# Altium schematic sheet dsp.SchDoc
size A2
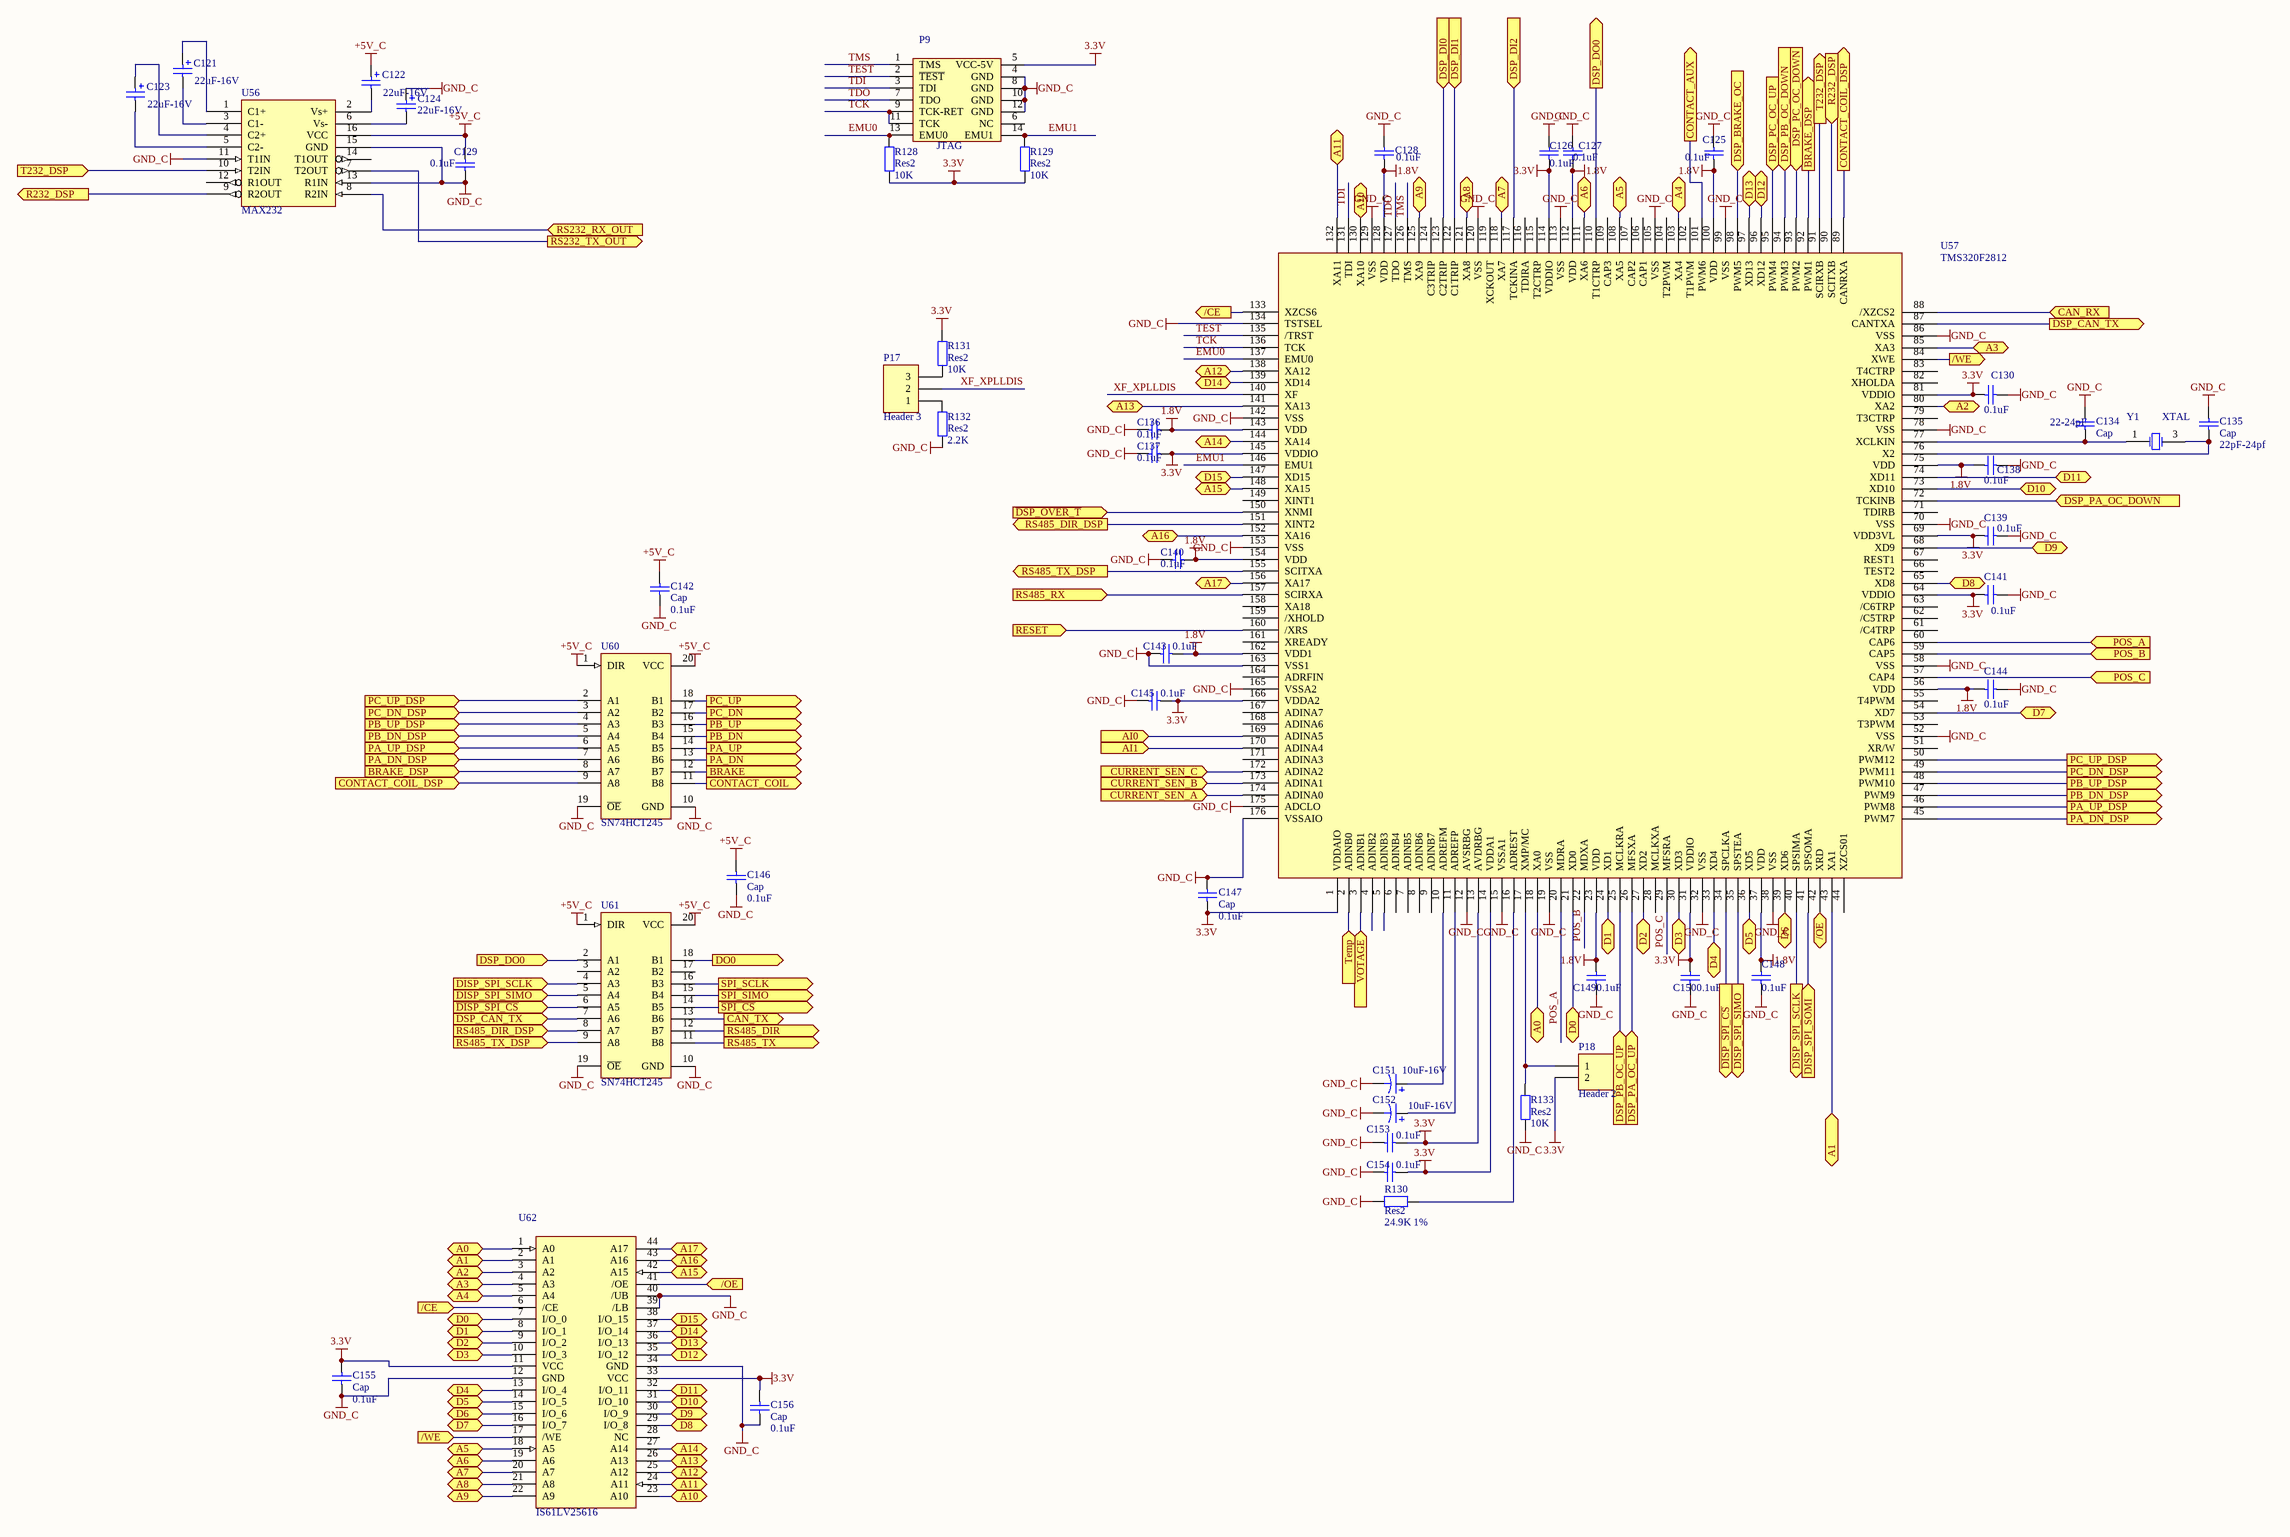
[diagram p0: dsp.SchDoc]

## Parts
C121  value 22uF-16V  [7343]  (hidden comment: 22uF)
C122  value 22uF-16V  [7343]  (hidden comment: 22uF)
C123  value 22uF-16V  [7343]  (hidden comment: 22uF)
C124  value 22uF-16V  [7343]  (hidden comment: 22uF)
C125  value 0.1uF  [1206]  (hidden comment: Cap)
C126  value 0.1uF  [1206]  (hidden comment: Cap)
C127  value 0.1uF  [1206]  (hidden comment: Cap)
C128  value 0.1uF  [1206]  (hidden comment: Cap)
C129  value 0.1uF  [1206]  (hidden comment: Cap)
C130  value 0.1uF  [1206]  (hidden comment: Cap)
C134  Cap  value 22-24pF  [1206]
C135  Cap  value 22pF-24pf  [1206]
C136  value 0.1uF  [1206]  (hidden comment: Cap)
C137  value 0.1uF  [1206]  (hidden comment: Cap)
C138  value 0.1uF  [1206]  (hidden comment: Cap)
C139  value 0.1uF  [1206]  (hidden comment: Cap)
C140  value 0.1uF  [1206]  (hidden comment: Cap)
C141  value 0.1uF  [1206]  (hidden comment: Cap)
C142  Cap  value 0.1uF  [1206]
C143  value 0.1uF  [1206]  (hidden comment: Cap)
C144  value 0.1uF  [1206]  (hidden comment: Cap)
C145  value 0.1uF  [1206]  (hidden comment: Cap)
C146  Cap  value 0.1uF  [1206]
C147  Cap  value 0.1uF  [1206]
C148  value 0.1uF  [1206]  (hidden comment: Cap)
C149  value 0.1uF  [1206]  (hidden comment: Cap)
C150  value 0.1uF  [1206]  (hidden comment: Cap)
C151  value 10uF-16V  [1206]  (hidden comment: Cap Pol1)
C152  value 10uF-16V  [1206]  (hidden comment: Cap Pol1)
C153  value 0.1uF  [1206]  (hidden comment: Cap)
C154  value 0.1uF  [1206]  (hidden comment: Cap)
C155  Cap  value 0.1uF  [1206]
C156  Cap  value 0.1uF  [1206]
P9  JTAG  [DIP14-2.54]
P17  Header 3  [HDR1X3]
P18  Header 2  [HDR1X2]
R128  Res2  value 10K  [1206]
R129  Res2  value 10K  [1206]
R130  Res2  value 24.9K 1%  [1206]
R131  Res2  value 10K  [1206]
R132  Res2  value 2.2K  [1206]
R133  Res2  value 10K  [1206]
U56  MAX232  [SO16_M]
U57  TMS320F2812  [LQFP176_N]
U60  SN74HCT245  [SO20_M]
U61  SN74HCT245  [SO20_M]
U62  IS61LV25616  [TSOP44 - duplicate]
Y1  XTAL  [SMD5032]

## Ports
/CE (in), /CE (out), /OE (in), /OE (out), /WE (in), /WE (out), A0, A1, A2, A3, A4, A5, A6, A7, A8, A9, A10, A11, A12, A13, A14, A15, A16, A17, AI0 (in), AI1 (in), BRAKE (out), BRAKE_DSP (in), BRAKE_DSP (out), CAN_RX (in), CAN_TX (out), CONTACT_AUX (out), CONTACT_COIL (out), CONTACT_COIL_DSP (in), CONTACT_COIL_DSP (out), CURRENT_SEN_A (in), CURRENT_SEN_B (in), CURRENT_SEN_C (in), D0, D1, D2, D3, D4, D5, D6, D7, D8, D9, D10, D11, D12, D13, D14, D15, DISP_SPI_SCLK (in), DISP_SPI_SCLK (out), DISP_SPI_SIMO (in), DISP_SPI_SIMO (out), DISP_SPI_SOMI (in), DO0 (out), DSP_BRAKE_OC (in), DSP_CAN_TX (in), DSP_CAN_TX (out), DSP_DI0 (in), DSP_DI1 (in), DSP_DI2 (in), DSP_DO0 (in), DSP_DO0 (out), DSP_PA_OC_DOWN (in), DSP_PA_OC_UP (in), DSP_PB_OC_DOWN (in), DSP_PB_OC_UP (in), DSP_PC_OC_DOWN (in), DSP_PC_OC_UP (in), PA_DN (out), PA_DN_DSP (in), PA_DN_DSP (out), PA_UP (out), PA_UP_DSP (in), PA_UP_DSP (out), PB_DN (out), PB_DN_DSP (in), PB_DN_DSP (out), PB_UP (out), PB_UP_DSP (in), PB_UP_DSP (out), PC_DN (out), PC_DN_DSP (in), PC_DN_DSP (out), PC_UP (out), PC_UP_DSP (in), PC_UP_DSP (out), POS_A (in), POS_B (in), POS_C (in), R232_DSP (in), R232_DSP (out), RESET (in), RS232_RX_OUT (in), RS232_TX_OUT (out), RS485_DIR (out), RS485_DIR_DSP (in), RS485_DIR_DSP (out), RS485_RX (in), RS485_TX (out), RS485_TX_DSP (in), RS485_TX_DSP (out), SPI_SCLK (out), SPI_SIMO (out), T232_DSP (in), T232_DSP (out), Temp (in), VOTAGE (in), ~{DISP_SPI_CS} (in), ~{DISP_SPI_CS} (out), ~{DSP_OVER_T} (in), ~{SPI_CS} (out)

## Nets
1.8V: C125.1 C127.1 C128.1 C136.1 C138.1 C140.1 C143.2 C144.1 C148.1 C149.1 U57.23(VDD) U57.37(VDD) U57.56(VDD) U57.75(VDD) U57.100(VDD) U57.112(VDD) U57.128(VDD) U57.143(VDD) U57.154(VDD) U57.162(VDD1)
3.3V: C126.1 C130.1 C137.1 C139.1 C141.1 C145.2 C147.2 C150.1 C153.2 C154.2 C155.2 C156.2 P9.5(VCC-5V) P18.2 R128.1 R129.1 R131.2 U57.1(VDDAIO) U57.13(AVDRBG) U57.14(VDDA1) U57.31(VDDIO) U57.64(VDDIO) U57.69(VDD3VL) U57.81(VDDIO) U57.114(VDDIO) U57.145(VDDIO) U57.166(VDDA2) U62.11(VCC) U62.33(VCC)
+5V_C: C122.1 C129.2 C142.2 C146.2 U56.16(VCC) U60.1(DIR) U60.20(VCC) U61.1(DIR) U61.20(VCC)
GND_C: C124.1 C125.2 C126.2 C127.2 C128.2 C129.1 C130.2 C134.2 C135.2 C136.2 C137.2 C138.2 C139.2 C140.2 C141.2 C142.1 C143.1 C144.2 C145.1 C146.1 C147.1 C148.2 C149.2 C150.2 C151.2 C152.2 C153.1 C154.1 C155.1 C156.1 P9.4(GND) P9.8(GND) P9.10(GND) P9.12(GND) R130.1 R132.1 R133.1 U56.11(T1IN) U56.13(R1IN) U56.15(GND) U57.12(AVSRBG) U57.15(VSSA1) U57.19(VSS) U57.32(VSS) U57.38(VSS) U57.52(VSS) U57.58(VSS) U57.70(VSS) U57.78(VSS) U57.86(VSS) U57.99(VSS) U57.105(VSS) U57.113(VSS) U57.120(VSS) U57.129(VSS) U57.134(TSTSEL) U57.142(VSS) U57.153(VSS) U57.163(VSS1) U57.165(VSSA2) U57.175(ADCLO) U57.176(VSSAIO) U60.10(GND) U60.19(~{OE}) U61.10(GND) U61.19(~{OE}) U62.12(GND) U62.34(GND) U62.39(/LB) U62.40(/UB)
/CE: U57.133(XZCS6) U62.6(/CE) ; port /CE
/OE: U57.42(XRD) U62.41(/OE) ; port /OE
/WE: U57.84(XWE) U62.17(/WE) ; port /WE
~{SPI_CS}: U61.14(B5) ; port ~{SPI_CS}
A0: U57.18(XA0) U62.1(A0) ; port A0
A1: U57.43(XA1) U62.2(A1) ; port A1
A2: U57.80(XA2) U62.3(A2) ; port A2
A3: U57.85(XA3) U62.4(A3) ; port A3
A4: U57.103(XA4) U62.5(A4) ; port A4
A5: U57.108(XA5) U62.18(A5) ; port A5
A6: U57.111(XA6) U62.19(A6) ; port A6
A7: U57.118(XA7) U62.20(A7) ; port A7
A8: U57.121(XA8) U62.21(A8) ; port A8
A9: U57.125(XA9) U62.22(A9) ; port A9
A10: U57.130(XA10) U62.23(A10) ; port A10
A11: U57.132(XA11) U62.24(A11) ; port A11
A12: U57.138(XA12) U62.25(A12) ; port A12
A13: U57.141(XA13) U62.26(A13) ; port A13
A14: U57.144(XA14) U62.27(A14) ; port A14
A15: U57.148(XA15) U62.42(A15) ; port A15
A16: U57.152(XA16) U62.43(A16) ; port A16
A17: U57.156(XA17) U62.44(A17) ; port A17
AI0: U57.169(ADINA5) ; port AI0
AI1: U57.170(ADINA4) ; port AI1
BRAKE: U60.12(B7) ; port BRAKE
BRAKE_DSP: U57.92(PWM1) U60.8(A7) ; port BRAKE_DSP
CAN_RX: U57.88(/XZCS2) ; port CAN_RX
CAN_TX: U61.13(B6) ; port CAN_TX
CONTACT_AUX: U57.101(PWM6) ; port CONTACT_AUX
CONTACT_COIL: U60.11(B8) ; port CONTACT_COIL
CONTACT_COIL_DSP: U57.89(CANRXA) U60.9(A8) ; port CONTACT_COIL_DSP
CURRENT_SEN_A: U57.174(ADINA0) ; port CURRENT_SEN_A
CURRENT_SEN_B: U57.173(ADINA1) ; port CURRENT_SEN_B
CURRENT_SEN_C: U57.172(ADINA2) ; port CURRENT_SEN_C
D0: U57.21(XD0) U62.7(I/O_0) ; port D0
D1: U57.24(XD1) U62.8(I/O_1) ; port D1
D2: U57.27(XD2) U62.9(I/O_2) ; port D2
D3: U57.30(XD3) U62.10(I/O_3) ; port D3
D4: U57.33(XD4) U62.13(I/O_4) ; port D4
D5: U57.36(XD5) U62.14(I/O_5) ; port D5
D6: U57.39(XD6) U62.15(I/O_6) ; port D6
D7: U57.54(XD7) U62.16(I/O_7) ; port D7
D8: U57.65(XD8) U62.29(I/O_8) ; port D8
D9: U57.68(XD9) U62.30(I/O_9) ; port D9
D10: U57.73(XD10) U62.31(I/O_10) ; port D10
D11: U57.74(XD11) U62.32(I/O_11) ; port D11
D12: U57.96(XD12) U62.35(I/O_12) ; port D12
D13: U57.97(XD13) U62.36(I/O_13) ; port D13
D14: U57.139(XD14) U62.37(I/O_14) ; port D14
D15: U57.147(XD15) U62.38(I/O_15) ; port D15
~{DISP_SPI_CS}: U57.34(SPCLKA) U61.6(A5) ; port ~{DISP_SPI_CS}
~{DSP_OVER_T}: U57.150(XNMI) ; port ~{DSP_OVER_T}
DISP_SPI_SCLK: U57.40(SPSIMA) U61.4(A3) ; port DISP_SPI_SCLK
DISP_SPI_SIMO: U57.35(SPSTEA) U61.5(A4) ; port DISP_SPI_SIMO
DISP_SPI_SOMI: U57.41(SPSOMA) ; port DISP_SPI_SOMI
DO0: U61.18(B1) ; port DO0
DSP_BRAKE_OC: U57.98(PWM5) ; port DSP_BRAKE_OC
DSP_CAN_TX: U57.87(CANTXA) U61.7(A6) ; port DSP_CAN_TX
DSP_DI0: U57.123(C2TRIP) ; port DSP_DI0
DSP_DI1: U57.122(C1TRIP) ; port DSP_DI1
DSP_DI2: U57.117(TCKINA) ; port DSP_DI2
DSP_DO0: U57.110(T1CTRP) U61.2(A1) ; port DSP_DO0
DSP_PA_OC_DOWN: U57.72(TCKINB) ; port DSP_PA_OC_DOWN
DSP_PA_OC_UP: U57.26(MFSXA) ; port DSP_PA_OC_UP
DSP_PB_OC_DOWN: U57.94(PWM3) ; port DSP_PB_OC_DOWN
DSP_PB_OC_UP: U57.25(MCLKRA) ; port DSP_PB_OC_UP
DSP_PC_OC_DOWN: U57.93(PWM2) ; port DSP_PC_OC_DOWN
DSP_PC_OC_UP: U57.95(PWM4) ; port DSP_PC_OC_UP
EMU0: P9.13(EMU0) R128.2 U57.137(EMU0)
EMU1: P9.14(EMU1) R129.2 U57.146(EMU1)
PA_DN: U60.13(B6) ; port PA_DN
PA_DN_DSP: U57.45(PWM7) U60.7(A6) ; port PA_DN_DSP
PA_UP: U60.14(B5) ; port PA_UP
PA_UP_DSP: U57.46(PWM8) U60.6(A5) ; port PA_UP_DSP
PB_DN: U60.15(B4) ; port PB_DN
PB_DN_DSP: U57.47(PWM9) U60.5(A4) ; port PB_DN_DSP
PB_UP: U60.16(B3) ; port PB_UP
PB_UP_DSP: U57.48(PWM10) U60.4(A3) ; port PB_UP_DSP
PC_DN: U60.17(B2) ; port PC_DN
PC_DN_DSP: U57.49(PWM11) U60.3(A2) ; port PC_DN_DSP
PC_UP: U60.18(B1) ; port PC_UP
PC_UP_DSP: U57.50(PWM12) U60.2(A1) ; port PC_UP_DSP
POS_A: U57.20(MDRA)
POS_A: U57.60(CAP6) ; port POS_A  [a separate net that carries the same name]
POS_B: U57.22(MDXA)
POS_B: U57.59(CAP5) ; port POS_B  [a separate net that carries the same name]
POS_C: U57.29(MFSRA)
POS_C: U57.57(CAP4) ; port POS_C  [a separate net that carries the same name]
R232_DSP: U56.9(R2OUT) U57.90(SCITXB) ; port R232_DSP
RESET: U57.160(/XRS) ; port RESET
RS232_RX_OUT: U56.8(R2IN) ; port RS232_RX_OUT
RS232_TX_OUT: U56.7(T2OUT) ; port RS232_TX_OUT
RS485_DIR: U61.12(B7) ; port RS485_DIR
RS485_DIR_DSP: U57.151(XINT2) U61.8(A7) ; port RS485_DIR_DSP
RS485_RX: U57.157(SCIRXA) ; port RS485_RX
RS485_TX: U61.11(B8) ; port RS485_TX
RS485_TX_DSP: U57.155(SCITXA) U61.9(A8) ; port RS485_TX_DSP
SPI_SCLK: U61.16(B3) ; port SPI_SCLK
SPI_SIMO: U61.15(B4) ; port SPI_SIMO
T232_DSP: U56.10(T2IN) U57.91(SCIRXB) ; port T232_DSP
~{TEST}: P9.2(~{TEST}) U57.135(/TRST)
TCK: P9.9(TCK-RET) P9.11(TCK) U57.136(TCK)
TDI: P9.3(TDI) U57.131(TDI)
TDO: P9.7(TDO) U57.127(TDO)
Temp: U57.2(ADINB0) ; port Temp
TMS: P9.1(TMS) U57.126(TMS)
VOTAGE: U57.3(ADINB1) ; port VOTAGE
XF_XPLLDIS: P17.2 U57.140(XF)
NetC121_1: C121.1 U56.1(C1+)
NetC121_2: C121.2 U56.3(C1-)
NetC122_2: C122.2 U56.2(Vs+)
NetC123_1: C123.1 U56.4(C2+)
NetC123_2: C123.2 U56.5(C2-)
NetC124_2: C124.2 U56.6(Vs-)
NetC134_1: C134.1 U57.77(XCLKIN) Y1.1(OSC1)
NetC135_1: C135.1 U57.76(X2) Y1.3(OSC2)
NetC151_1: C151.1 U57.10(ADREFM)
NetC152_1: C152.1 U57.11(ADREFP)
NetP17_1: P17.1 R132.2
NetP17_3: P17.3 R131.1
NetP18_1: P18.1 R133.2 U57.17(XMP/MC)
NetR130_2: R130.2 U57.16(ADREST)

Not connected (* = marked no-connect by the designer): P9 6(NC); U56 12(R1OUT) 14(T1OUT); U57 4(ADINB2) 5(ADINB3) 6(ADINB4) 7(ADINB5) 8(ADINB6) 9(ADINB7) 28(MCLKXA) 44(XZCS01) 51(XR/W) 53(T3PWM) 55(T4PWM) 61(/C4TRP) 62(/C5TRP) 63(/C6TRP) 66(TEST2) 67(REST1) 71(TDIRB) 79(T3CTRP) 82(XHOLDA) 83(T4CTRP) 102(T1PWM) 104(T2PWM) 106(CAP1) 107(CAP2) 109(CAP3) 115(T2CTRP) 116(TDIRA) 119(XCKOUT) 124(C3TRIP) 149(XINT1) 158(XA18) 159(/XHOLD) 161(XREADY) 164(ADRFIN) 167(ADINA7) 168(ADINA6) 171(ADINA3); U61 3(A2) 17(B2); U62 28(NC)

## Library data of the parts
C121-C124 = Cap Pol2: Polarized Capacitor (Axial); Published: 8-Jun-2000; LatestRevisionDate: 17-Jul-2002; LatestRevisionNote: Re-released for DXP Platform.; PackageReference: POLAR0.8; Publisher: Altium Limited
C125-C130 C134-C150 C153-C156 = Cap: Capacitor; Published: 8-Jun-2000; LatestRevisionDate: 17-Jul-2002; LatestRevisionNote: Re-released for DXP Platform.; PackageReference: RAD-0.3; Publisher: Altium Limited
C151 C152 = Cap Pol1: Polarized Capacitor (Radial); Published: 8-Jun-2000; LatestRevisionDate: 17-Jul-2002; LatestRevisionNote: Re-released for DXP Platform.; PackageReference: RB7.6-15; Publisher: Altium Limited
P17 = Header 3: Header, 3-Pin; LatestRevisionDate: 17-Jul-2002; LatestRevisionNote: Re-released for DXP Platform.; Publisher: Altium Limited
P18 = Header 2: Header, 2-Pin; LatestRevisionDate: 17-Jul-2002; LatestRevisionNote: Re-released for DXP Platform.; Publisher: Altium Limited
R128-R133 = Res2: Resistor; Published: 8-Jun-2000; LatestRevisionDate: 17-Jul-2002; LatestRevisionNote: Re-released for DXP Platform.; PackageReference: AXIAL-0.4; Publisher: Altium Limited
U56 = MAX232: DUAL EIA-232 DRIVER/RECEIVER
Y1 = XTAL: Crystal Oscillator; Published: 8-Jun-2000; LatestRevisionDate: 17-Jul-2002; LatestRevisionNote: Re-released for DXP Platform.; PackageReference: R38; Publisher: Altium Limited